# Altium schematic sheet TopLevel.SchDoc: =project_title
size Tabloid; CompanyName: Luxonis Holding; Organization: Luxonis Holding; Address1: 1925 Harmony Park Drive; Address2: Westminster, CO; Address3: 80234; Address4: United States; SheetNumber: 1; SheetTotal: 14
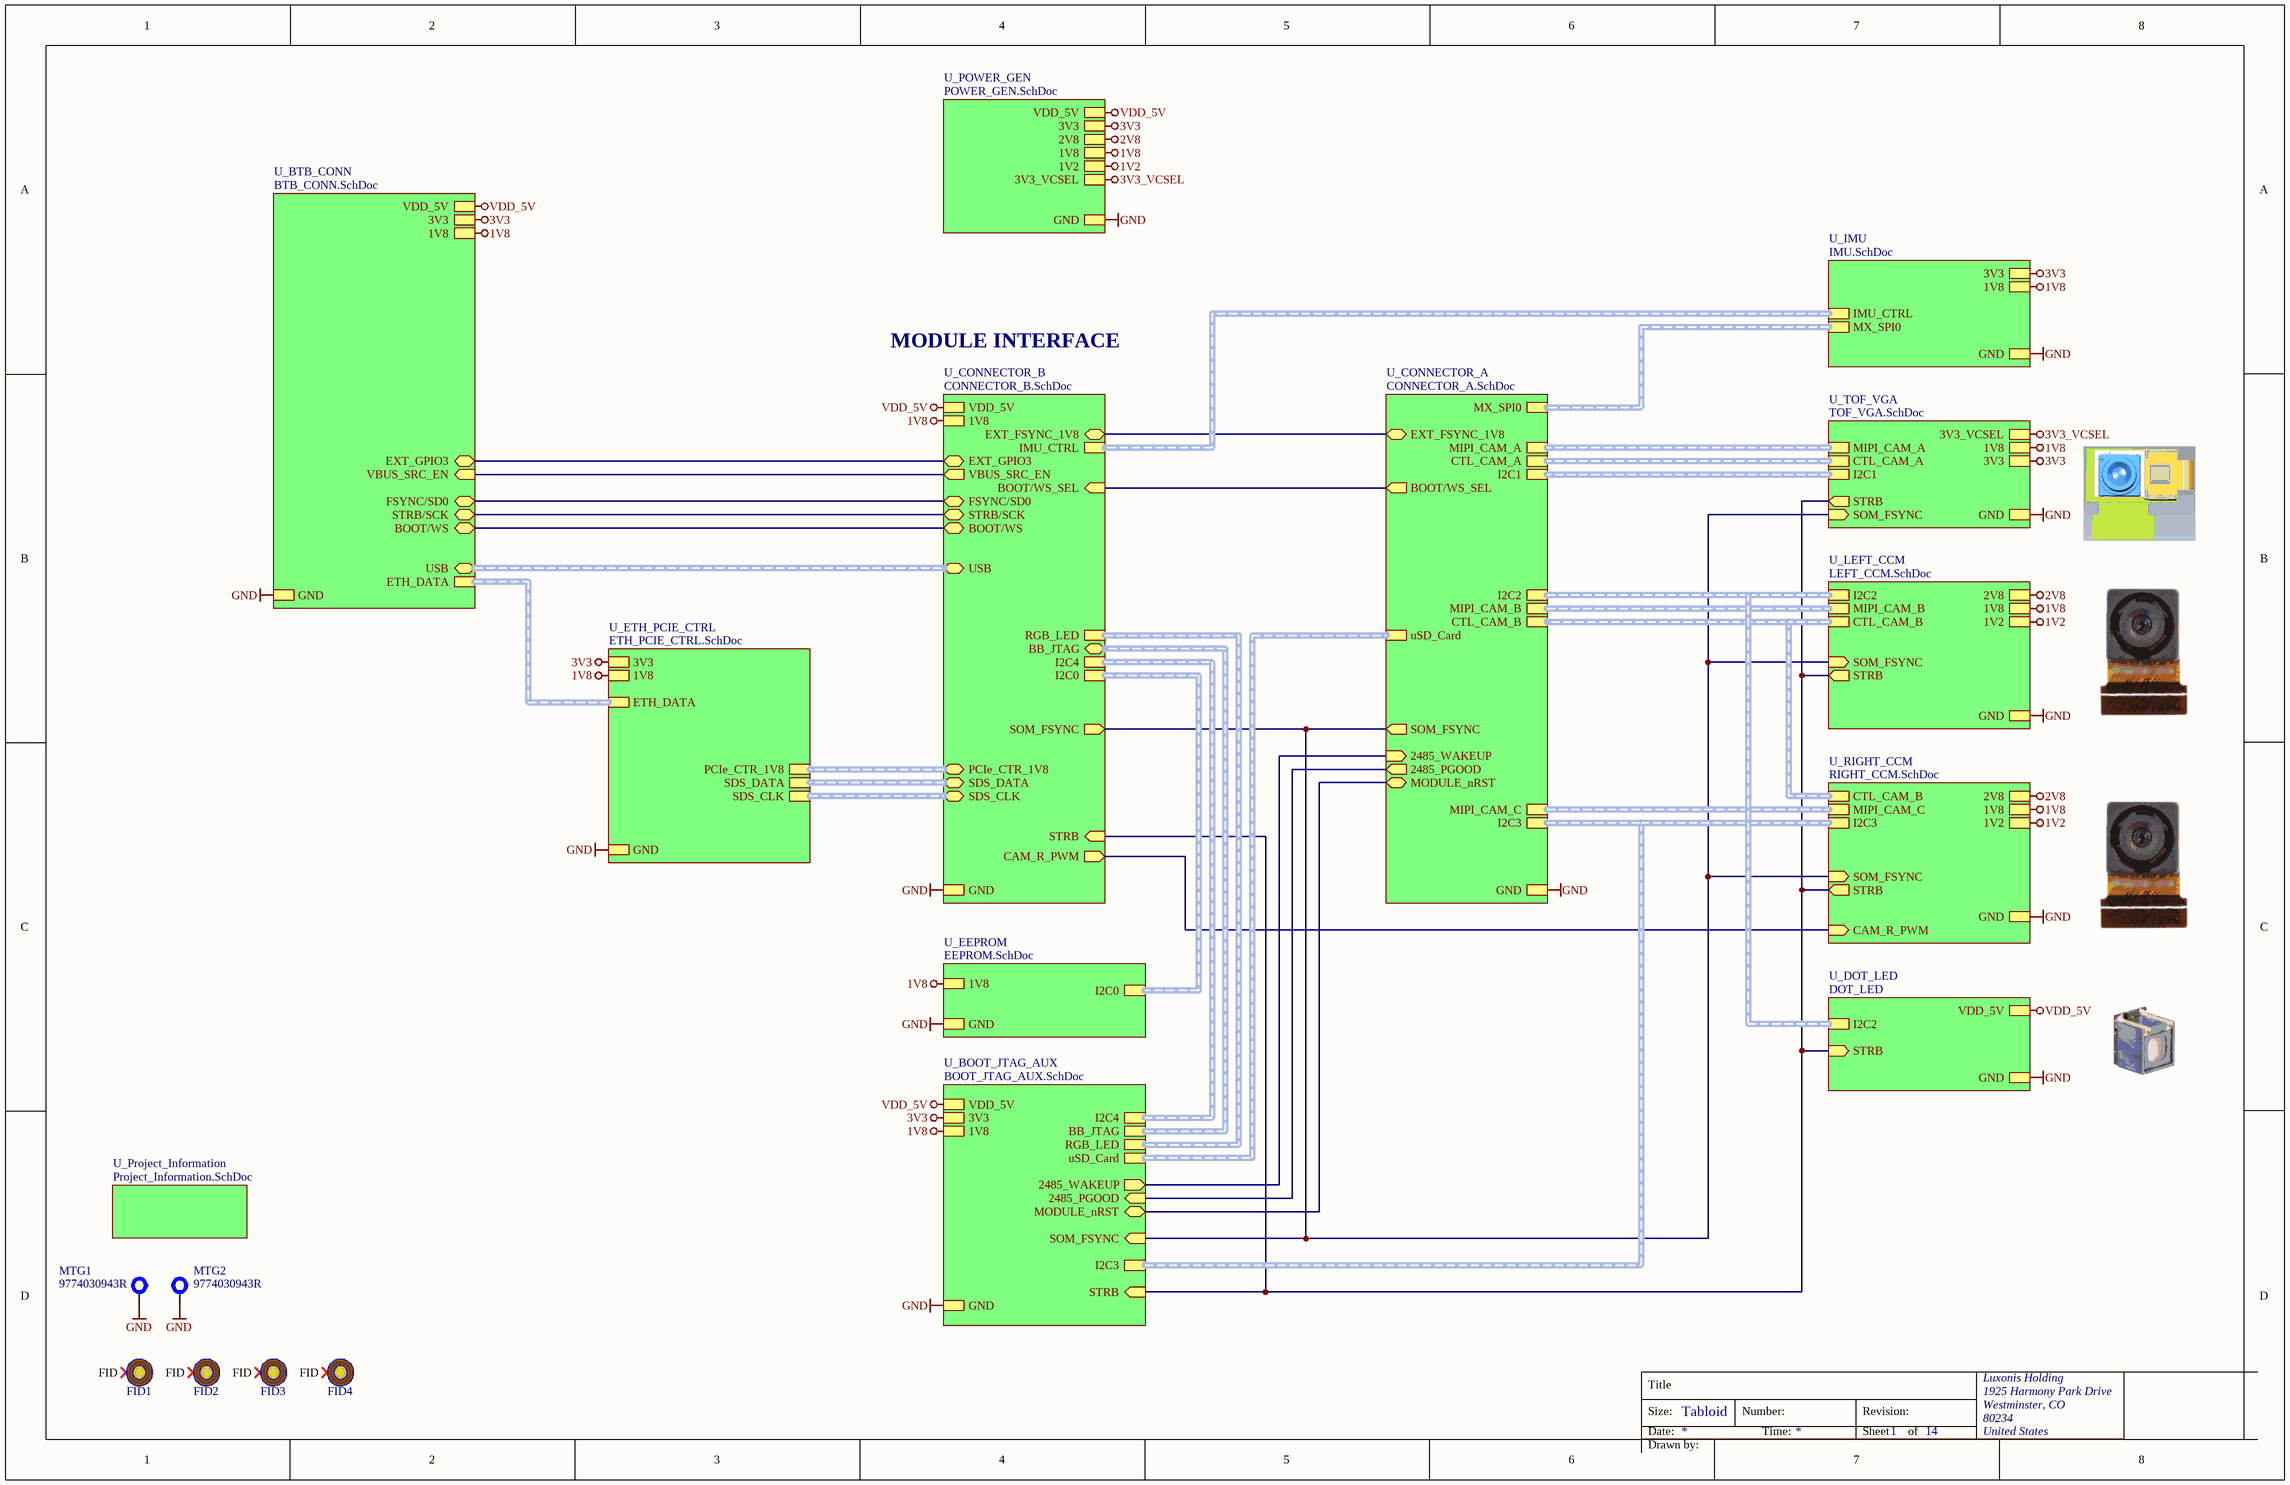
[diagram p0: TopLevel.SchDoc]

## Parts
FID1  FIDUCIAL_ROUND_1MM  [FIDUCIAL_ROUND_1MM]  (value not drawn)  (no BOM)
FID2  FIDUCIAL_ROUND_1MM  [FIDUCIAL_ROUND_1MM]  (value not drawn)  (no BOM)
FID3  FIDUCIAL_ROUND_1MM  [FIDUCIAL_ROUND_1MM]  (value not drawn)  (no BOM)
FID4  FIDUCIAL_ROUND_1MM  [FIDUCIAL_ROUND_1MM]  (value not drawn)  (no BOM)
MTG1  9774030943R  [9774030943R]
MTG2  9774030943R  [9774030943R]

## Sub-sheets
U_BOOT_JTAG_AUX = BOOT_JTAG_AUX.SchDoc: RGB_LED (harness RGB_LED), BB_JTAG (harness BB_JTAG), uSD_Card (harness uSD_Card), 2485_WAKEUP (out), I2C3 (harness I2C3), 2485_PGOOD (in), 1V8, 3V3, VDD_5V, STRB (in), SOM_FSYNC (in), I2C4 (harness I2C4), GND, MODULE_nRST (bidir)
U_BTB_CONN = BTB_CONN.SchDoc: VBUS_SRC_EN (in), GND, ETH_DATA (harness ETH_DATA), VDD_5V, 3V3, 1V8, USB (bidir, harness USB), EXT_GPIO3 (bidir), FSYNC/SD0 (bidir), STRB/SCK (bidir), BOOT/WS (bidir)
U_CONNECTOR_A = CONNECTOR_A.SchDoc: uSD_Card (harness uSD_Card), MIPI_CAM_C (harness MIPI_CAM_C), CTL_CAM_A (harness CTL_CAM_A), MIPI_CAM_A (harness MIPI_CAM_A), MIPI_CAM_B (harness MIPI_CAM_B), GND, I2C3 (harness I2C3), CTL_CAM_B (harness CTL_CAM_B), SOM_FSYNC (out), 2485_WAKEUP (in), 2485_PGOOD (out), MX_SPI0 (harness MX_SPI0), I2C1 (harness I2C1), I2C2 (harness I2C2), EXT_FSYNC_1V8 (bidir), MODULE_nRST (bidir), BOOT/WS_SEL (out)
U_CONNECTOR_B = CONNECTOR_B.SchDoc: I2C0 (harness I2C0), VDD_5V, PCIe_CTR_1V8 (bidir, harness PCIe_CTR_1V8), BB_JTAG (bidir, harness BB_JTAG), SDS_DATA (bidir, harness SDS_DATA), SDS_CLK (bidir, harness SDS_CLK), IMU_CTRL (harness IMU_CTRL), RGB_LED (harness RGB_LED), 1V8, CAM_R_PWM (out), SOM_FSYNC (out), I2C4 (harness I2C4), GND, USB (bidir, harness USB), VBUS_SRC_EN (out), EXT_GPIO3 (bidir), BOOT/WS (bidir), STRB/SCK (bidir), FSYNC/SD0 (bidir), BOOT/WS_SEL (in), EXT_FSYNC_1V8 (bidir), STRB (in)
U_DOT_LED = DOT_LED: VDD_5V, GND, I2C2 (harness I2C2), STRB (in)
U_EEPROM = EEPROM.SchDoc: 1V8, I2C0 (harness I2C0), GND
U_ETH_PCIE_CTRL = ETH_PCIE_CTRL.SchDoc: ETH_DATA (harness ETH_DATA), SDS_DATA (harness SDS_DATA), 3V3, SDS_CLK (harness SDS_CLK), 1V8, PCIe_CTR_1V8 (harness PCIe_CTR_1V8), GND
U_IMU = IMU.SchDoc: 3V3, 1V8, MX_SPI0 (harness MX_SPI0), IMU_CTRL (harness IMU_CTRL), GND
U_LEFT_CCM = LEFT_CCM.SchDoc: I2C2 (harness I2C2), CTL_CAM_B (harness CTL_CAM_B), MIPI_CAM_B (harness MIPI_CAM_B), 1V2, 2V8, 1V8, SOM_FSYNC (in), STRB (out), GND
U_POWER_GEN = POWER_GEN.SchDoc: GND, 3V3, 1V8, 1V2, 2V8, VDD_5V, 3V3_VCSEL
U_Project_Information = Project_Information.SchDoc: no entries
U_RIGHT_CCM = RIGHT_CCM.SchDoc: MIPI_CAM_C (harness MIPI_CAM_C), I2C3 (harness I2C3), 1V2, 2V8, 1V8, CTL_CAM_B (harness CTL_CAM_B), CAM_R_PWM (in), SOM_FSYNC (in), GND, STRB (out)
U_TOF_VGA = TOF_VGA.SchDoc: 3V3_VCSEL, 1V8, GND, I2C1 (harness I2C1), CTL_CAM_A (harness CTL_CAM_A), MIPI_CAM_A (harness MIPI_CAM_A), SOM_FSYNC (in), 3V3, STRB (out)

## Nets
1V2: sheet U_POWER_GEN/1V2, sheet U_RIGHT_CCM/1V2, sheet U_LEFT_CCM/1V2
1V8: sheet U_CONNECTOR_B/1V8, sheet U_ETH_PCIE_CTRL/1V8, sheet U_BOOT_JTAG_AUX/1V8, sheet U_POWER_GEN/1V8, sheet U_TOF_VGA/1V8, sheet U_RIGHT_CCM/1V8, sheet U_LEFT_CCM/1V8, sheet U_IMU/1V8, sheet U_EEPROM/1V8, sheet U_BTB_CONN/1V8
2V8: sheet U_POWER_GEN/2V8, sheet U_RIGHT_CCM/2V8, sheet U_LEFT_CCM/2V8
3V3: sheet U_ETH_PCIE_CTRL/3V3, sheet U_BOOT_JTAG_AUX/3V3, sheet U_POWER_GEN/3V3, sheet U_TOF_VGA/3V3, sheet U_IMU/3V3, sheet U_BTB_CONN/3V3
3V3_VCSEL: sheet U_POWER_GEN/3V3_VCSEL, sheet U_TOF_VGA/3V3_VCSEL
GND: MTG1.1 MTG2.1 ; sheet U_CONNECTOR_B/GND, sheet U_CONNECTOR_A/GND, sheet U_ETH_PCIE_CTRL/GND, sheet U_BOOT_JTAG_AUX/GND, sheet U_POWER_GEN/GND, sheet U_TOF_VGA/GND, sheet U_RIGHT_CCM/GND, sheet U_LEFT_CCM/GND, sheet U_IMU/GND, sheet U_EEPROM/GND, sheet U_DOT_LED/GND, sheet U_BTB_CONN/GND
VDD_5V: sheet U_CONNECTOR_B/VDD_5V, sheet U_BOOT_JTAG_AUX/VDD_5V, sheet U_POWER_GEN/VDD_5V, sheet U_DOT_LED/VDD_5V, sheet U_BTB_CONN/VDD_5V
(unnamed): sheet U_CONNECTOR_B/CAM_R_PWM, sheet U_RIGHT_CCM/CAM_R_PWM
(unnamed): sheet U_CONNECTOR_B/SOM_FSYNC, sheet U_CONNECTOR_A/SOM_FSYNC, sheet U_BOOT_JTAG_AUX/SOM_FSYNC, sheet U_TOF_VGA/SOM_FSYNC, sheet U_RIGHT_CCM/SOM_FSYNC, sheet U_LEFT_CCM/SOM_FSYNC
(unnamed): sheet U_CONNECTOR_B/VBUS_SRC_EN, sheet U_BTB_CONN/VBUS_SRC_EN
(unnamed): sheet U_CONNECTOR_B/EXT_GPIO3, sheet U_BTB_CONN/EXT_GPIO3
(unnamed): sheet U_CONNECTOR_B/BOOT/WS, sheet U_BTB_CONN/BOOT/WS
(unnamed): sheet U_CONNECTOR_B/STRB/SCK, sheet U_BTB_CONN/STRB/SCK
(unnamed): sheet U_CONNECTOR_B/FSYNC/SD0, sheet U_BTB_CONN/FSYNC/SD0
(unnamed): sheet U_CONNECTOR_B/BOOT/WS_SEL, sheet U_CONNECTOR_A/BOOT/WS_SEL
(unnamed): sheet U_CONNECTOR_B/EXT_FSYNC_1V8, sheet U_CONNECTOR_A/EXT_FSYNC_1V8
(unnamed): sheet U_CONNECTOR_B/STRB, sheet U_BOOT_JTAG_AUX/STRB, sheet U_TOF_VGA/STRB, sheet U_RIGHT_CCM/STRB, sheet U_LEFT_CCM/STRB, sheet U_DOT_LED/STRB
(unnamed): sheet U_CONNECTOR_A/2485_WAKEUP, sheet U_BOOT_JTAG_AUX/2485_WAKEUP
(unnamed): sheet U_CONNECTOR_A/2485_PGOOD, sheet U_BOOT_JTAG_AUX/2485_PGOOD
(unnamed): sheet U_CONNECTOR_A/MODULE_nRST, sheet U_BOOT_JTAG_AUX/MODULE_nRST

Not connected (* = marked no-connect by the designer): FID1 FID*; FID2 FID*; FID3 FID*; FID4 FID*

## Buses and harness runs
harness sheet U_BOOT_JTAG_AUX/BB_JTAG = sheet U_CONNECTOR_B/BB_JTAG
harness sheet U_BOOT_JTAG_AUX/I2C3 = sheet U_CONNECTOR_A/I2C3 = sheet U_RIGHT_CCM/I2C3
harness sheet U_BOOT_JTAG_AUX/I2C4 = sheet U_CONNECTOR_B/I2C4
harness sheet U_BOOT_JTAG_AUX/RGB_LED = sheet U_CONNECTOR_B/RGB_LED
harness sheet U_BOOT_JTAG_AUX/uSD_Card = sheet U_CONNECTOR_A/uSD_Card
harness sheet U_BTB_CONN/ETH_DATA = sheet U_ETH_PCIE_CTRL/ETH_DATA
harness sheet U_BTB_CONN/USB = sheet U_CONNECTOR_B/USB
harness sheet U_CONNECTOR_A/CTL_CAM_A = sheet U_TOF_VGA/CTL_CAM_A
harness sheet U_CONNECTOR_A/CTL_CAM_B = sheet U_LEFT_CCM/CTL_CAM_B = sheet U_RIGHT_CCM/CTL_CAM_B
harness sheet U_CONNECTOR_A/I2C1 = sheet U_TOF_VGA/I2C1
harness sheet U_CONNECTOR_A/I2C2 = sheet U_DOT_LED/I2C2 = sheet U_LEFT_CCM/I2C2
harness sheet U_CONNECTOR_A/MIPI_CAM_A = sheet U_TOF_VGA/MIPI_CAM_A
harness sheet U_CONNECTOR_A/MIPI_CAM_B = sheet U_LEFT_CCM/MIPI_CAM_B
harness sheet U_CONNECTOR_A/MIPI_CAM_C = sheet U_RIGHT_CCM/MIPI_CAM_C
harness sheet U_CONNECTOR_A/MX_SPI0 = sheet U_IMU/MX_SPI0
harness sheet U_CONNECTOR_B/I2C0 = sheet U_EEPROM/I2C0
harness sheet U_CONNECTOR_B/IMU_CTRL = sheet U_IMU/IMU_CTRL
harness sheet U_CONNECTOR_B/PCIe_CTR_1V8 = sheet U_ETH_PCIE_CTRL/PCIe_CTR_1V8
harness sheet U_CONNECTOR_B/SDS_CLK = sheet U_ETH_PCIE_CTRL/SDS_CLK
harness sheet U_CONNECTOR_B/SDS_DATA = sheet U_ETH_PCIE_CTRL/SDS_DATA

## Notes on the sheet
- MODULE INTERFACE
- Title
- Size:
- Date:
- Tabloid
- Number:
- Time:
- Revision:
- Sheet
- of
- Drawn by:

## Library data of the parts
FID1-FID4 = FIDUCIAL: Fiducial with various available footprints
MTG1 MTG2 = CMP-090-000000-4: Spacers/Standoffs; Manufacturer 1: Wurth Electronics; Manufacturer Part Number 1: 9774030943R